# EAGLE design nano_v1.0 (EAGLE 6.3)
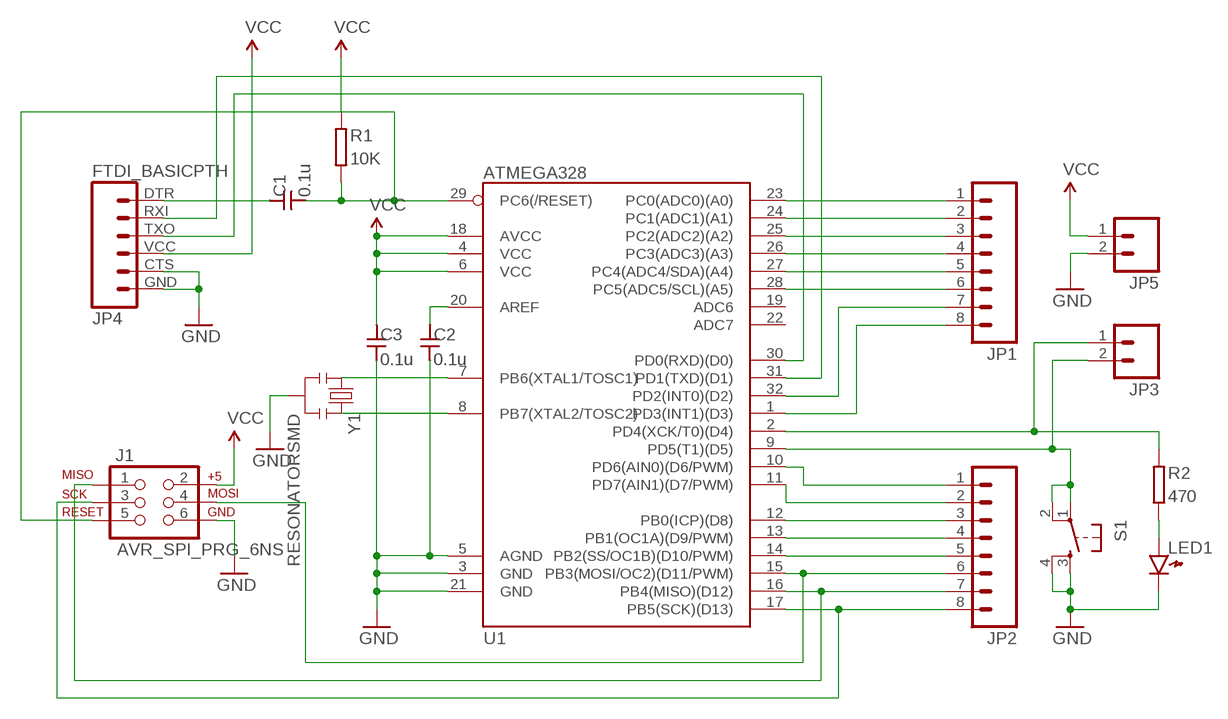
[diagram p0: schematic, sheet 1]

## Parts
C1  0.1u  CAPACITOR2012  [SMD2012]
C2  0.1u  CAPACITOR2012  [SMD2012]
C3  0.1u  CAPACITOR2012  [SMD2012]
J1  AVR_SPI_PRG_6NS  [2X3-NS]
JP1  M081X08  [1X08]
JP2  M081X08  [1X08]
JP3  M02PTH  [1X02]
JP4  FTDI_BASICPTH  [FTDI_BASIC]
JP5  M021X02_NO_SILK  [1X02_NO_SILK]
LED1  LED2012  [LED2012]
R1  10K  REGISTOR2012  [SMD2012]
R2  470  REGISTOR2012  [SMD2012]
S1  TAC_SWITCHSMD  [TACTILE_SWITCH_SMD]
U1  ATMEGA328  [TQFP32-08]
Y1  RESONATORSMD  [RESONATOR-SMD]

## Nets
GND: C2.2 C3.2 J1.6 JP4.CTS JP4.GND JP5.2 LED1.K S1.3 S1.4 U1.3(GND) U1.5(AGND) U1.21(GND) Y1.2
N$1: J1.3 JP2.8 U1.17(PB5(SCK)(D13))
N$2: J1.1 JP2.7 U1.16(PB4(MISO)(D12))
N$3: J1.4 JP2.6 U1.15(PB3(MOSI/OC2)(D11/PWM))
N$4: JP2.5 U1.14(PB2(SS/OC1B)(D10/PWM))
N$5: JP2.4 U1.13(PB1(OC1A)(D9/PWM))
N$6: JP2.3 U1.12(PB0(ICP)(D8))
N$7: JP2.2 U1.11(PD7(AIN1)(D7/PWM))
N$8: JP2.1 U1.10(PD6(AIN0)(D6/PWM))
N$9: JP1.1 U1.23(PC0(ADC0)(A0))
N$10: JP1.2 U1.24(PC1(ADC1)(A1))
N$11: JP1.3 U1.25(PC2(ADC2)(A2))
N$12: JP1.4 U1.26(PC3(ADC3)(A3))
N$13: JP1.5 U1.27(PC4(ADC4/SDA)(A4))
N$14: JP1.6 U1.28(PC5(ADC5/SCL)(A5))
N$15: JP4.TXO U1.30(PD0(RXD)(D0))
N$16: JP4.RXI U1.31(PD1(TXD)(D1))
N$17: C1.2 J1.5 R1.2 U1.29(PC6(/RESET))
N$19: JP3.2 S1.1 S1.2 U1.9(PD5(T1)(D5))
N$20: JP1.7 U1.32(PD2(INT0)(D2))
N$21: JP1.8 U1.1(PD3(INT1)(D3))
N$22: C2.1 U1.20(AREF)
N$23: U1.7(PB6(XTAL1/TOSC1)) Y1.1
N$24: U1.8(PB7(XTAL2/TOSC2)) Y1.3
N$25: C1.1 JP4.DTR
N$26: JP3.1 R2.1 U1.2(PD4(XCK/T0)(D4))
N$27: LED1.A R2.2
VCC: C3.1 J1.2 JP4.VCC JP5.1 R1.1 U1.4(VCC) U1.6(VCC) U1.18(AVCC)
Unconnected: U1.19(ADC6) U1.22(ADC7)

## Library data of the parts
C1-C3 = kawaiti:CAPACITOR: Generic Capacitor
J1 = SparkFun-Connectors:AVR_SPI_PRG_6: AVR ISP 6 Pin This is the reduced ISP connector for AVR programming. Common on Arduino. This footprint will take up less PCB space and can be used with a 10-pin to 6-pin adapter such as SKU: BOB-08508
JP1 JP2 = kawaiti:M08: Header 8 Standard 8-pin 0.1" header. Use with straight break away headers (SKU : PRT-00116), right angle break away headers (PRT-00553), swiss pins (PRT-00743), machine pins (PRT-00117), and female headers (PRT-00115).
JP3 JP5 = SparkFun-Connectors:M02: Header 2 Standard 2-pin 0.1" header. Use with straight break away headers (SKU : PRT-00116), right angle break away headers (PRT-00553), swiss pins (PRT-00743), machine pins (PRT-00117), and female headers (PRT-00115). Molex polarized connector foot print use with SKU : PRT-08233 with associated crimp pins and housings.
JP4 = SparkFun-Connectors:FTDI_BASIC: FTDI Basic header with labels
LED1 = kawaiti:LED: Generic LEDs
R1 R2 = kawaiti:REGISTOR: Generic Registor
S1 = SparkFun-Electromechanical:TAC_SWITCH: Momentary Switch Button commonly used for reset or general input. Spark Fun Electronics SKU : COM-00097
U1 = kawaiti:ATMEGA328: ATmega328P-AU TQFP 32 pin
Y1 = SparkFun-FreqCtrl:RESONATOR: Resonator Small SMD resonator. This is the itty bitty 10/20MHz resonators with built in caps. CSTCE10M0G55 and CSTCE20M0V53. Footprint has been reviewed closely but hasn't been tested yet.

## Board
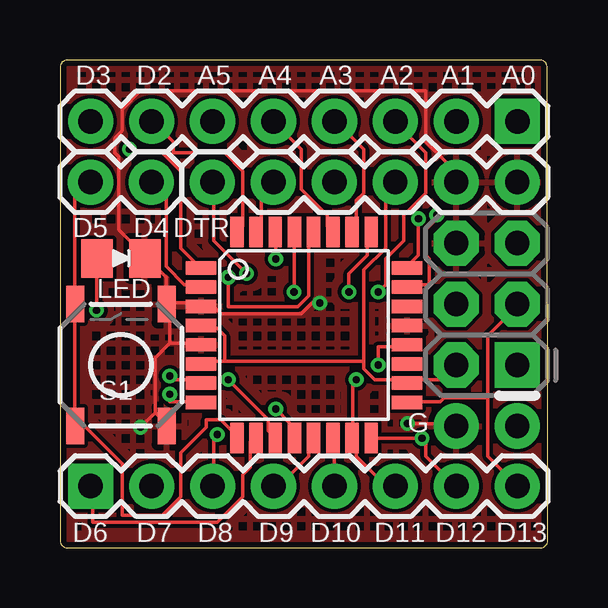
[diagram p1: board, top side]
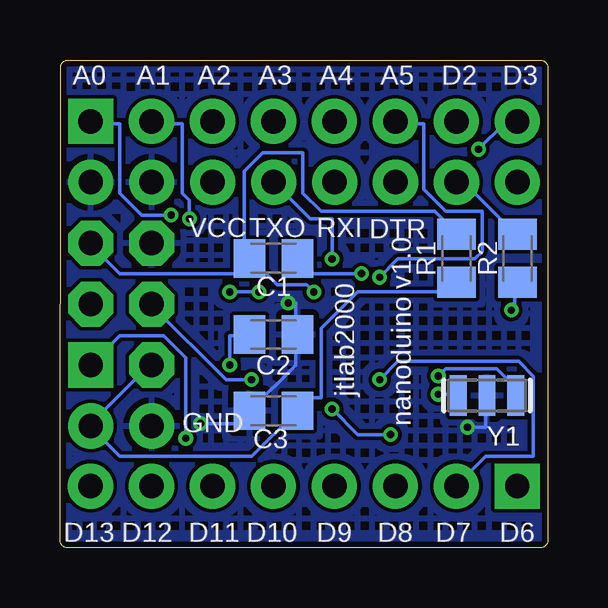
[diagram p2: board, bottom side, seen from below]

Size 20.33 x 20.33 mm. Coordinates in mm from the lower left corner, seen from the top.
Outline: 19.99,20.33 0.32,20.33 arc90 0,20.01 0,0.32 arc90 0.32,0 20.01,0 arc90 20.33,0.32 20.3,20.01 arc90 19.99,20.33
Copper layers (1*16): Top 0.035mm / dielectric 1.5mm / Bottom 0.035mm
Design rules "default": minimum track width 6mil, minimum drill 12mil, track to track 6mil, track to pad 6mil, pad to pad 6mil, via to via 6mil, smd to smd 0mil, copper to edge 10mil, drill to drill 10mil, minimum pad ring 10mil, minimum via ring 6mil, stop-mask expansion 2mil, vias tented up to drill 100mil, thermal gap 10mil

### Footprints (pad centres in the part's own frame; a part is rotated, then mirrored left to right if it is on the bottom)
SMD2012 = smd 1.3 x 1.6: 1 -1,0; 2 1,0
2X3-NS = drill 1.016 pad 1.88 square: 1 -2.54,-1.27 | drill 1.016 pad 1.88 octagon: 2 -2.54,1.27; 3 0,-1.27; 4 0,1.27; 5 2.54,-1.27; 6 2.54,1.27
1X08 = drill 1.016 pad 1.88 square: 1 0,0 | drill 1.016 pad 1.88: 2 2.54,0; 3 5.08,0; 4 7.62,0; 5 10.16,0; 6 12.7,0; 7 15.24,0; 8 17.78,0
1X02 = drill 1.016 pad 1.88: 1 0,0; 2 2.54,0
FTDI_BASIC = drill 1.016 pad 1.88: CTS 10.16,0; DTR 0,0; GND 12.7,0; RXI 2.54,0; TXO 5.08,0; VCC 7.62,0
1X02_NO_SILK = drill 1.016 pad 1.88: 1 0,0; 2 2.54,0
LED2012 = smd 1.3 x 1.6: A -1,0; K 1,0
TACTILE_SWITCH_SMD = smd 1.524 x 0.762: 1 -2.54,1.905; 2 2.54,1.905; 3 -2.54,-1.905; 4 2.54,-1.905
TQFP32-08 = smd 1.27 x 0.559: 1 -4.293,2.8; 2 -4.293,2; 3 -4.293,1.2; 4 -4.293,0.4; 5 -4.293,-0.4; 6 -4.293,-1.2; 7 -4.293,-2; 8 -4.293,-2.8; 17 4.293,-2.8; 18 4.293,-2; 19 4.293,-1.2; 20 4.293,-0.4; 21 4.293,0.4; 22 4.293,1.2; 23 4.293,2; 24 4.293,2.8 | smd 0.559 x 1.27: 9 -2.8,-4.293; 10 -2,-4.293; 11 -1.2,-4.293; 12 -0.4,-4.293; 13 0.4,-4.293; 14 1.2,-4.293; 15 2,-4.293; 16 2.8,-4.293; 25 2.8,4.293; 26 2,4.293; 27 1.2,4.293; 28 0.4,4.293; 29 -0.4,4.293; 30 -1.2,4.293; 31 -2,4.293; 32 -2.8,4.293
RESONATOR-SMD = smd 0.7 x 1.7: 1 -1.2,0; 2 0,0; 3 1.2,0

### Placement (x,y rotation side)
C1  11.43,12.06 180 bottom
C2  11.43,8.89 0 bottom
C3  11.43,5.71 180 bottom
J1  17.78,10.16 90 top
JP1  19.06,17.77 180 top
JP2  1.28,2.57 0 top
JP3  3.81,15.24 180 top
JP4  6.35,15.24 0 top
JP5  19.05,5.08 180 top
LED1  2.54,12.06 0 top
R1  3.81,12.06 90 bottom
R2  1.27,12.06 270 bottom
S1  2.54,7.62 90 top
U1  10.17,8.87 0 top
Y1  2.54,6.35 180 bottom

### Tracks (layer width: path | path; a pad name or v marks a point on that pad's centre or on a via)
GND  (via drill 0.3)
  Top 0.152: 16.46,12.95 J1.6 | v14.48,5.18 16.46,5.18 JP5.2 | 4.57,8.53 5.79,8.53 U1.5 | 4.57,8.53 4.57,10.06 S1.4 | 3.96,5.64 4.42,5.18 S1.3 | 3.96,5.64 3.96,7.92 4.57,8.53 | S1.4 4.42,10.21 4.42,11.28 3.66,12.04 LED1.K 3.5,12.19 2.44,13.26 2.44,16.31 2.29,16.46 2.29,17.07 2.59,17.37 2.59,18.29 3.35,19.05 15.24,19.05 15.24,16.92 16.46,15.7 16.46,15.24 JP4.CTS | 3.96,5.64 v3.35,5.03 | S1.4 4.57,10.21 5.79,10.21 U1.3 5.94,10.06 6.4,10.06 6.71,9.75 10.06,9.75 10.52,10.21 v10.82,10.21
  Bottom 0.152: J1.6 16.61,12.8 16.64,12.83 | v14.48,5.18 12.95,5.18 12.5,5.64 C3.2 12.34,5.79 10.52,7.62 10.52,8.84 C2.2 10.52,8.99 10.52,10.21 v10.82,10.21 | v3.35,5.03 2.59,5.03 2.59,6.25 Y1.2
  pour Bottom (hatched): 0,20.32 20.32,20.32 20.32,0 0,0
  pour Top (hatched): 0,20.32 20.32,20.32 20.32,0 0,0
N$1
  Top 0.152: 17.83,6.25 16,6.25 15.85,6.1 14.48,6.1 U1.17 | 17.83,6.25 17.83,3.81 19.05,2.59 JP2.8 | 17.83,6.25 17.83,8.84 19.05,10.06 J1.3
N$2  (via drill 0.3)
  Top 0.152: U1.16 13.11,4.57 v15.09,4.57 15.24,4.57 15.24,3.81 16.46,2.59 JP2.7
  Bottom 0.152: J1.1 17.83,8.84 16,8.84 15.09,7.92 v15.09,4.57
N$3  (via drill 0.3)
  Top 0.152: JP2.6 13.87,2.59 13.56,2.59 12.34,3.81 12.34,4.42 12.19,4.57 U1.15 12.19,4.72 12.19,6.86 v12.34,7.01
  Bottom 0.152: v12.34,7.01 13.41,7.01 16.46,10.06 J1.4
N$4
  Top 0.152: U1.14 11.43,4.57 11.43,2.59 JP2.5
N$5
  Top 0.152: U1.13 10.52,4.57 10.36,4.42 10.36,3.81 8.99,2.44 JP2.4
N$6  (via drill 0.3)
  Top 0.152: v8.99,5.79 9.6,5.18 9.6,4.88 9.75,4.72 U1.12 | v6.55,4.72 6.4,4.57 6.4,2.59 JP2.3
  Bottom 0.152: v8.99,5.79 7.92,4.72 v6.55,4.72
N$7  (via drill 0.3)
  Top 0.152: v7.01,7.01 8.69,5.33 8.69,4.88 8.84,4.72 U1.11
  Bottom 0.152: v7.01,7.01 6.25,7.77 1.22,7.77 0.61,7.16 0.61,3.81 2.59,3.81 3.81,2.59 JP2.2
N$8
  Top 0.152: U1.10 8.08,4.57 7.92,4.42 7.92,3.35 7.62,3.05 7.62,2.13 6.55,1.07 1.37,1.07 1.37,2.44 JP2.1
N$9  (via drill 0.3)
  Top 0.152: v15.7,13.87 15.7,13.72 15.24,13.26 15.24,12.19 15.39,12.04 15.39,10.97 14.48,10.97 U1.23
  Bottom 0.152: v15.7,13.87 16.92,13.87 17.83,14.78 17.83,17.68 19.05,17.68 JP1.1
N$10  (via drill 0.3)
  Top 0.152: v14.94,13.72 14.94,12.19 14.48,11.73 U1.24
  Bottom 0.152: v14.94,13.72 14.94,14.48 15.24,14.78 15.24,17.68 16.46,17.68 JP1.2
N$11  (via drill 0.3)
  Top 0.152: v12.04,10.67 12.04,11.43 12.8,12.19 12.8,12.95 12.95,13.11 U1.25 | v13.26,10.67 13.56,10.97 13.56,12.04 14.33,12.8 14.33,13.87 15.24,14.78 15.24,16.46 14.02,17.68 JP1.3
  Bottom 0.152: v13.26,10.67 v12.04,10.67
N$12
  Top 0.152: U1.26 12.19,13.26 12.34,13.41 12.34,14.48 12.65,14.78 12.65,16.61 11.58,17.68 JP1.4
N$13
  Top 0.152: U1.27 11.28,13.26 11.12,13.41 11.12,13.87 10.06,14.94 10.06,16.61 8.99,17.68 JP1.5
N$14  (via drill 0.3)
  Top 0.152: U1.28 10.36,12.95 10.36,10.52 9.91,10.06 7.01,10.06 v7.01,11.28
  Bottom 0.152: v7.01,11.28 6.25,12.04 3.05,12.04 2.74,12.34 2.74,14.02 4.27,14.02 5.18,14.94 5.18,17.68 6.25,17.68 JP1.6
N$15  (via drill 0.3)
  Top 0.152: v8.99,12.04 8.99,13.11 U1.30
  Bottom 0.152: v8.99,12.04 8.99,13.72 9.91,13.72 JP4.TXO
N$16
  Top 0.152: U1.31 8.23,13.26 8.38,13.41 8.38,14.78 8.84,15.24 JP4.RXI
N$17  (via drill 0.3)
  Top 0.152: v9.75,10.67 9.75,13.11 U1.29
  Bottom 0.152: v9.75,10.67 10.06,10.97 11.28,10.97 11.73,11.43 | 11.73,11.43 12.34,12.04 C1.2 12.5,12.19 12.65,12.19 12.65,15.7 11.89,16.46 10.21,16.46 10.21,14.78 9.45,14.02 4.72,14.02 3.81,13.11 R1.2 | 11.73,11.43 17.83,11.43 19.05,12.65 J1.5
N$19
  Top 0.152: U1.9 7.32,4.72 6.71,5.33 6.1,5.33 6.1,5.03 5.03,3.96 5.03,2.13 4.27,1.37 2.59,1.37 2.59,3.5 1.07,5.03 0.76,5.03 S1.1 0.61,5.18 0.61,10.06 S1.2 0.61,10.21 0.61,14.63 1.22,15.24 JP3.2
N$20
  Top 0.152: U1.32 7.47,13.26 7.62,13.41 7.62,15.7 6.86,16.46 4.72,16.46 4.72,16.92 3.96,17.68 JP1.7
N$21  (via drill 0.3)
  Top 0.152: v2.9,16.61 2.9,16.46 4.27,16.46 5.03,15.7 5.03,12.5 5.79,11.73 U1.1
  Bottom 0.152: v2.9,16.61 1.83,17.68 1.37,17.68 JP1.8
N$22  (via drill 0.3)
  Top 0.152: v13.26,7.62 13.26,8.38 14.33,8.38 U1.20
  Bottom 0.152: v13.26,7.62 13.26,8.84 12.5,8.84 C2.1
N$23  (via drill 0.3)
  Top 0.152: v4.57,7.16 4.57,7.01 5.79,7.01 U1.7
  Bottom 0.152: v4.57,7.16 4.27,7.47 2.13,7.47 1.37,6.71 1.37,6.4 Y1.1
N$24  (via drill 0.3)
  Top 0.152: v4.57,6.4 4.57,6.1 5.79,6.1 U1.8
  Bottom 0.152: v4.57,6.4 3.81,6.4 Y1.3
N$25  (via drill 0.3)
  Top 0.152: v7.77,11.43 6.4,12.8 6.4,15.24 JP4.DTR
  Bottom 0.152: v7.77,11.43 9.75,11.43 10.36,12.04 C1.1
N$26
  Top 0.152: JP3.1 4.42,14.63 4.42,11.73 5.18,10.97 5.79,10.97 U1.2
  Bottom 0.152: JP3.1 3.5,15.24 1.37,13.11 R2.1
N$27  (via drill 0.3)
  Top 0.152: v1.52,9.91 1.52,12.04 LED1.A
  Bottom 0.152: v1.52,9.91 1.37,9.91 1.37,10.97 R2.2
VCC
  Top 0.152: 6.86,7.77 5.94,7.77 U1.6 | 6.86,7.77 6.86,8.84 6.55,9.14 5.94,9.14 U1.4 | J1.2 16.46,7.62 16.46,7.01 14.48,7.01 U1.18 14.33,7.01 13.11,7.01 12.65,7.47 12.65,7.77 | 12.65,7.77 6.86,7.77 | 12.65,7.77 12.65,11.58 13.56,12.5 13.56,14.94 13.87,15.24 JP4.VCC
  Bottom 0.152: R1.1 3.81,10.97 4.12,10.67 7.92,10.67 9.45,9.14 9.45,6.25 9.91,6.25 10.36,5.79 C3.1 10.52,5.64 12.34,3.81 17.83,3.81 19.05,5.03 JP5.1 19.05,5.18 16.61,7.62 J1.2

### Text on the board
tPlace: D3 | D2 | A5 | A4 | A3 | A2 | A1 | A0 | DTR | D6 | D7 | D8 | D9 | D10 | D11 | D12 | D13
bPlace: D3 | D2 | A5 | A4 | A3 | A2 | A1 | A0 | DTR | D6 | D7 | D8 | D9 | D10 | D11 | D12 | D13
tNames: D5 | D4 | LED | G
bNames: RXI | TXO | VCC | jtlab2000 | nanoduino v1.0 | GND